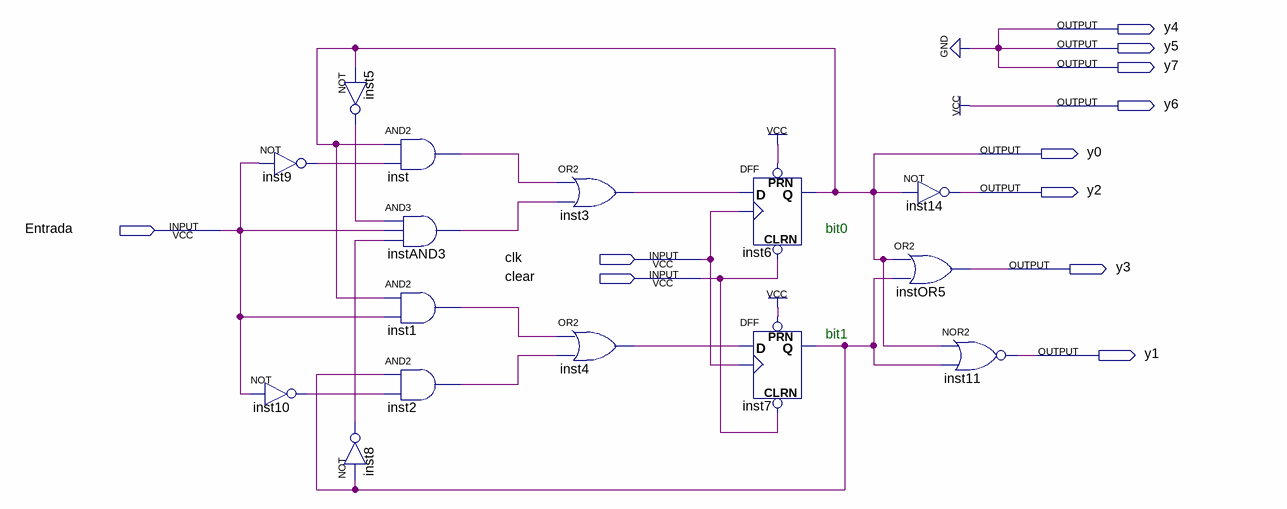
[diagram p0: schematic sheet]
// Quartus schematic fsm_nome.bdf as structural Verilog: 15 symbols, 11 pins
module fsm_nome (
  input  Entrada,
  input  clk,
  input  clear,
  output y4,
  output y5,
  output y7,
  output y6,
  output y0,
  output y2,
  output y3,
  output y1
);

  wire inst1_out, inst2_out, inst3_out, inst4_out, inst5_out, inst7_q, inst8_out, inst9_out, inst10_out,
       inst_out, instAND3_out;

  not inst9 (inst9_out, Entrada);
  not inst10 (inst10_out, Entrada);
  not inst5 (inst5_out, y0);
  and inst (inst_out, y0, inst9_out);
  and instAND3 (instAND3_out, inst5_out, Entrada, inst8_out);
  and inst1 (inst1_out, y0, Entrada);
  and inst2 (inst2_out, inst7_q, inst10_out);
  not inst8 (inst8_out, inst7_q);
  or inst3 (inst3_out, inst_out, instAND3_out);
  or inst4 (inst4_out, inst1_out, inst2_out);
  DFF inst6 (.CLRN(clear), .CLK(clk), .D(inst3_out), .PRN(1'b1), .Q(y0));
  DFF inst7 (.CLRN(clear), .CLK(clk), .D(inst4_out), .PRN(1'b1), .Q(inst7_q));
  not inst14 (y2, y0);
  or instOR5 (y3, y0, inst7_q);
  nor inst11 (y1, y0, inst7_q);

  assign y4 = 1'b0;
  assign y5 = 1'b0;
  assign y6 = 1'b1;
  assign y7 = 1'b0;

  // Notes on the sheet:
  //   bit0
  //   bit1
endmodule
